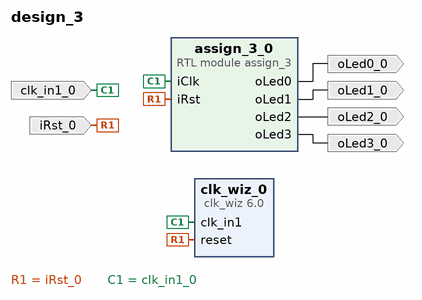
[diagram p0: block diagram of the top level]
# Vivado block design design_3, xc7z020clg400-1, Vivado 2020.1
create_bd_design design_3

create_bd_port -dir I iRst_0
create_bd_port -dir I -type clk clk_in1_0
create_bd_port -dir O oLed0_0
create_bd_port -dir O oLed1_0
create_bd_port -dir O oLed2_0
create_bd_port -dir O oLed3_0

create_bd_cell -type module -reference assign_3 assign_3_0
create_bd_cell -type ip -vlnv xilinx.com:ip:clk_wiz:6.0 clk_wiz_0
set_property -dict [list \
  CONFIG.CLKIN1_JITTER_PS 80.0 \
  CONFIG.CLKOUT1_JITTER 312.659 \
  CONFIG.CLKOUT1_PHASE_ERROR 245.713 \
  CONFIG.CLKOUT1_REQUESTED_OUT_FREQ 25 \
  CONFIG.CLK_IN1_BOARD_INTERFACE sys_clock \
  CONFIG.MMCM_CLKFBOUT_MULT_F 36.500 \
  CONFIG.MMCM_CLKIN1_PERIOD 8.000 \
  CONFIG.MMCM_CLKOUT0_DIVIDE_F 36.500 \
  CONFIG.MMCM_DIVCLK_DIVIDE 5 \
] [get_bd_cells clk_wiz_0]

# ---- connections ----

connect_bd_net -net iRst_0_1 [get_bd_ports iRst_0] [get_bd_pins assign_3_0/iRst] [get_bd_pins clk_wiz_0/reset]
connect_bd_net -net clk_in1_0_1 [get_bd_ports clk_in1_0] [get_bd_pins clk_wiz_0/clk_in1] [get_bd_pins assign_3_0/iClk]
connect_bd_net [get_bd_pins assign_3_0/oLed0] [get_bd_ports oLed0_0]
connect_bd_net [get_bd_pins assign_3_0/oLed1] [get_bd_ports oLed1_0]
connect_bd_net [get_bd_pins assign_3_0/oLed2] [get_bd_ports oLed2_0]
connect_bd_net [get_bd_pins assign_3_0/oLed3] [get_bd_ports oLed3_0]

validate_bd_design
save_bd_design
